# Altium project JuniorDesign_FinalProj.PrjPcb
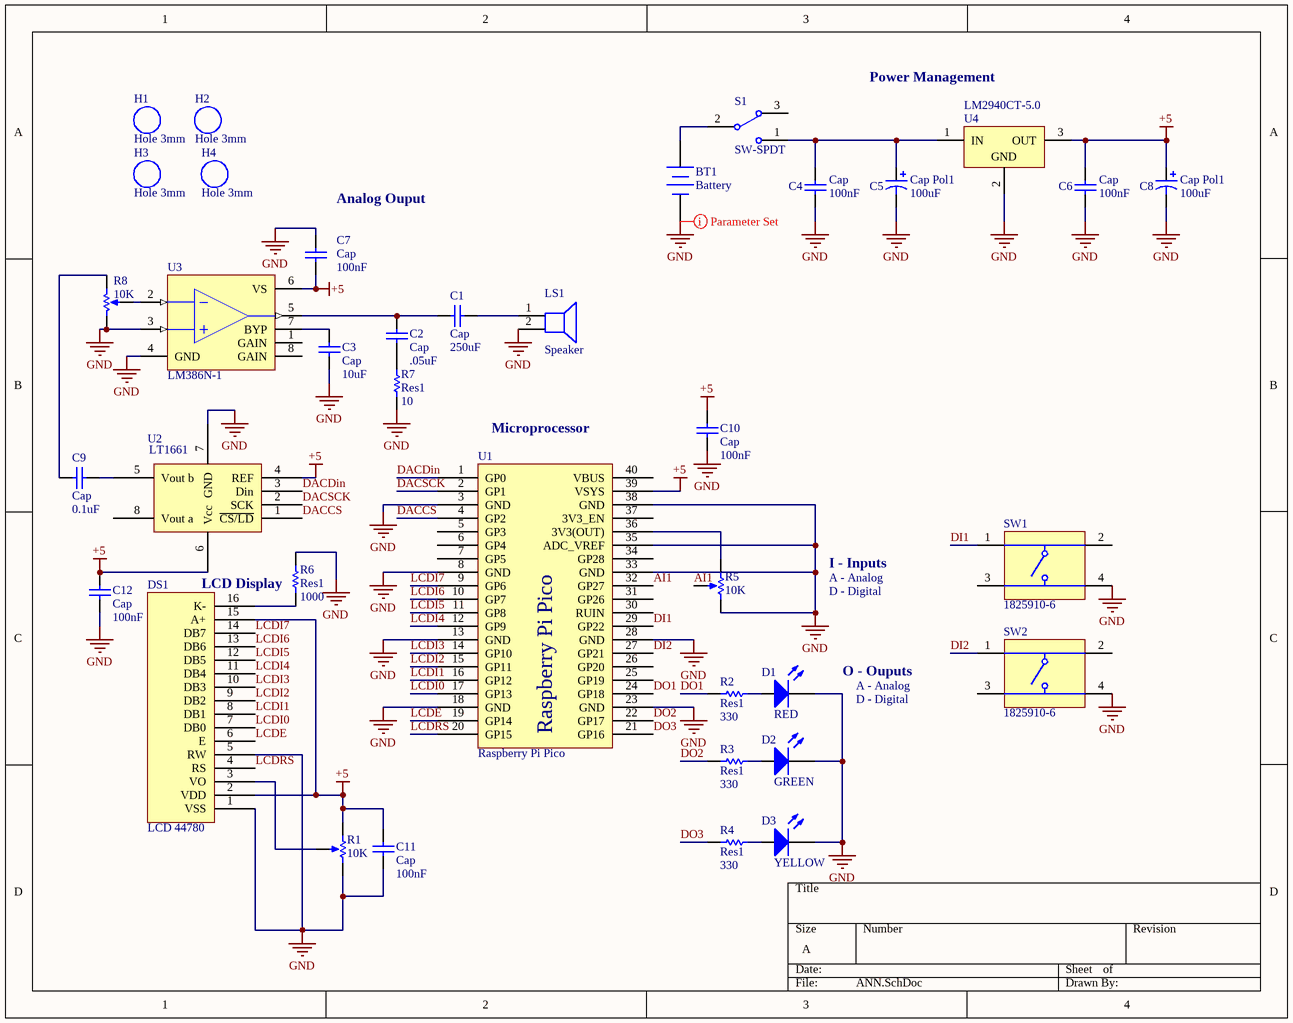
[diagram p0: ANN.SchDoc]
1 sheet, 37 parts. Net scope: global (net labels, ports and power ports of the same name join across sheets).
Board file: ANN.PcbDoc

## Sheet ANN.SchDoc
size A; SheetNumber: 1; SheetTotal: 1; SPICEModelCacheXOHBOOKO: <root> / <DocumentId>XOHBOOKO</DocumentId> / <CacheFrame Number="0"> / <Model Name="led0" Kind="MDL"> / <Text>*Typ INFRARED GaAs LED: Vf=1.2V Vr=5V If=40mA trr=3uS / *LED Pinout: 1=A, 2=K / .MODEL LED0 D (IS=93.5P RS=84M N=2.63 BV=5 IBV=10U / + CJO=2.97P VJ=.75 M=.333 TT=4.32U)</Text> / </Model> / </CacheFrame> / </root>

### Parts
BT1  Battery  [BAT-2]
C1  Cap  value 250uF  [RAD-0.3]
C2  Cap  value .05uF  [RAD-0.3]
C3  Cap  value 10uF  [RAD-0.3]
C4  Cap  value 100nF  [RAD-0.3]
C5  Cap Pol1  value 100uF  [RB7.6-15]
C6  Cap  value 100nF  [RAD-0.3]
C7  Cap  value 100nF  [RAD-0.3]
C8  Cap Pol1  value 100uF  [RB7.6-15]
C9  Cap  value 0.1uF  [RAD-0.3]
C10  Cap  value 100nF  [RAD-0.3]
C11  Cap  value 100nF  [RAD-0.3]
C12  Cap  value 100nF  [RAD-0.3]
D1  RED  [LED-0]
D2  GREEN  [LED-0]
D3  YELLOW  [LED-0]
DS1  LCD 44780  [OLED 16x2]
H1  Hole 3mm  [Hole 3mm]
H2  Hole 3mm  [Hole 3mm]
H3  Hole 3mm  [Hole 3mm]
H4  Hole 3mm  [Hole 3mm]
LS1  Speaker  [PIN2]
R1  value 10K  [POT OFFSET 100_1]  (hidden comment: RPot_2)
R2  Res1  value 330  [AXIAL-0.3]
R3  Res1  value 330  [AXIAL-0.3]
R4  Res1  value 330  [AXIAL-0.3]
R5  value 10K  [POT OFFSET 100_1]  (hidden comment: RPot_2)
R6  Res1  value 1000  [AXIAL-0.3]
R7  Res1  value 10  [AXIAL-0.3]
R8  value 10K  [POT OFFSET 100_1]  (hidden comment: RPot_2)
S1  SW-SPDT  [SW DPST jameco]
SW1  1825910-6  [TECO-1825910-6_V]
SW2  1825910-6  [TECO-1825910-6_V]
U1  Raspberry Pi Pico  [Raspberry Pi Pico]
U2  LT1661  [DIP-8]
U3  LM386N-1  [DIP-8]
U4  LM2940CT-5.0  [T03B]

### Nets
+5: C6.2 C7.2 C8.1 C10.2 C11.2 C12.2 DS1.2(VDD) DS1.15(A+) R1.1(TOP) U1.39(VSYS) U2.4(REF) U2.6(Vcc) U3.6(VS) U4.3(OUT)
GND: BT1.2(-) C3.1 C4.1 C5.2 C6.1 C7.1 C8.2 C10.1 C11.1 C12.1 D1.2(K) D2.2(K) D3.2(K) DS1.1(VSS) DS1.5(RW) LS1.2 R1.3(BOT) R5.3(BOT) R6.2 R7.1 R8.3(BOT) SW1.4 SW2.4 U1.3(GND) U1.8(GND) U1.13(GND) U1.18(GND) U1.23(GND) U1.28(GND) U1.33(GND) U1.35(ADC_VREF) U1.38(GND) U2.7(GND) U3.3(IN+) U3.4(GND) U4.2(GND)
AI1: R5.2(TAP) U1.32(GP27)
DACCS: U1.4(GP2) U2.1(~{CS/LD})
DACDin: U1.1(GP0) U2.3(Din)
DACSCK: U1.2(GP1) U2.2(SCK)
DI1: SW1.1 U1.29(GP22)
DI2: SW2.1 U1.27(GP21)
DO1: R2.1 U1.24(GP18)
DO2: R3.1 U1.22(GP17)
DO3: R4.1 U1.21(GP16)
LCDE: DS1.6(E) U1.19(GP14)
LCDI0: DS1.7(DB0) U1.17(GP13)
LCDI1: DS1.8(DB1) U1.16(GP12)
LCDI2: DS1.9(DB2) U1.15(GP11)
LCDI3: DS1.10(DB3) U1.14(GP10)
LCDI4: DS1.11(DB4) U1.12(GP9)
LCDI5: DS1.12(DB5) U1.11(GP8)
LCDI6: DS1.13(DB6) U1.10(GP7)
LCDI7: DS1.14(DB7) U1.9(GP6)
LCDRS: DS1.4(RS) U1.20(GP15)
NetBT1_1: BT1.1(+) S1.2
NetC1_1: C1.1 LS1.1
NetC1_2: C1.2 C2.2 U3.5(OUT)
NetC2_1: C2.1 R7.2
NetC3_2: C3.2 U3.7(BYP)
NetC4_2: C4.2 C5.1 S1.1 U4.1(IN)
NetC9_1: C9.1 U2.5(Vout_b)
NetC9_2: C9.2 R8.1(TOP)
NetD1_1: D1.1(A) R2.2
NetD2_1: D2.1(A) R3.2
NetD3_1: D3.1(A) R4.2
NetDS1_3: DS1.3(VO) R1.2(TAP)
NetDS1_16: DS1.16(K-) R6.1
NetR5_1: R5.1(TOP) U1.36(3V3(OUT))
NetR8_2: R8.2(TAP) U3.2(IN-)

Not connected (* = marked no-connect by the designer): S1 3; SW1 2 3; SW2 2 3; U1 5(GP3) 6(GP4) 7(GP5) 25(GP19) 26(GP20) 30(RUIN) 31(GP26) 34(GP28) 37(3V3_EN) 40(VBUS); U2 8(Vout_a); U3 1(GAIN) 8(GAIN)

### Layout directives
rule Width Constraint [Pref Width = 30mil    Min Width = 30mil    Max Width = 30mil]: GND

### Notes on the sheet
- Power Management
- (near C7) Analog Ouput
- (near U1) Microprocessor
- I - Inputs
- LCD Display
- A - Analog
- D - Digital
- O - Ouputs

### Library data of the parts
BT1 = Battery: Multicell Battery; Published: 24-Mar-1999; LatestRevisionDate: 17-Jul-2002; LatestRevisionNote: Re-released for DXP Platform.; PackageReference: BAT-2; Publisher: Altium Limited; PackageDescription: Battery; 2 Leads
C1-C4 C6 C7 C9-C12 = Cap: Capacitor; Published: 8-Jun-2000; LatestRevisionDate: 17-Jul-2002; LatestRevisionNote: Re-released for DXP Platform.; PackageReference: RAD-0.3; Publisher: Altium Limited; PackageDescription: Radial Cap, Thru-Hole; 2 Leads; 0.3 in Pin Spacing
C5 C8 = Cap Pol1: Polarized Capacitor (Radial); Published: 8-Jun-2000; LatestRevisionDate: 17-Jul-2002; LatestRevisionNote: Re-released for DXP Platform.; PackageReference: RB7.6-15; Publisher: Altium Limited; PackageDescription: Polarized Capacitor (Radial); 2 Leads
D1-D3 = LED0: Typical INFRARED GaAs LED; Published: 8-Jun-2000; LatestRevisionDate: 08-Jul-2005; LatestRevisionNote: Mech Layer 1 removed.; PackageReference: LED-0; Publisher: Altium Limited; PackageDescription: LED; 2 Leads
LS1 = Speaker: Loudspeaker; Published: 24-Mar-1999; LatestRevisionDate: 17-Jul-2002; LatestRevisionNote: Re-released for DXP Platform.; PackageReference: PIN2; Publisher: Altium Limited
R1 R5 R8 = RPot_5: Potentiometer; Sim Note: Enter the Resistance value and the set point into parameter fields.; Set Position: 0.5; Published: 8-Jun-2000; LatestRevisionDate: 17-Jul-2002; LatestRevisionNote: Re-released for DXP Platform.; PackageReference: VR5; Publisher: Altium Limited; PackageDescription: Variable Resistor, Thru-Hole; 3 Leads
R2-R4 R6 R7 = Res1: Resistor; Published: 8-Jun-2000; LatestRevisionDate: 17-Jul-2002; LatestRevisionNote: Re-released for DXP Platform.; PackageReference: AXIAL-0.3; Publisher: Altium Limited; PackageDescription: Axial Device, Thru-Hole; 2 Leads; 0.3 in Pin Spacing
S1 = SW-SPDT: SPDT Subminiature Toggle Switch, Right Angle Mounting, Vertical Actuation; Published: 24-Mar-1999; LatestRevisionDate: 17-Dec-2003; LatestRevisionNote: Schematic revised, PCB Footprint replaced.; DatasheetVersion: 05-Dec-2000; PackageReference: TL36WW15050; Publisher: Altium Limited; PackageDescription: Switch; 4 Leads; ComponentLink1Description: Manufacturer Link; ComponentLink1URL: http://www.apem.com
SW1 SW2 = CMP-1684-00021-1: Tact Switch, SPST-NO, 0.05 A, -35 to 85 degC, 4-Pin THD, RoHS, Bulk; Manufacturer: TE Connectivity; Maximum Contact Resistance: 100mOhm; Mechanical Life: 100000Cycles; Bushing Type: Unthreaded; Switch Configuration: OFF(ON); Maximum DC Voltage Rating: 24V; Contact Rating @ Voltage: 0.05A@24VDC; Actuator Color: Black; Body Orientation: Straight; Function: MomentaryContact; Illumination: N/R; Actuator Style: RoundButton; Actuator Material: PolybutyleneTerephthalate; Dielectric Strength: 500VAC; Pole Throw Configuration: SPST; Actuator Length: 1.4mm; Product Weight: N/A; Contact Material: CopperAlloy; Housing Material: N/A; Terminal Type: PCPins; Minimum Insulation Resistance: 100MOhm; Package Description: 4-Pin Through Hole Device, Body 5.99 x 5.99 mm, Pitch 6.5 mm; Part No: 1825910-6; Package Reference: THD; Base Material: N/A; Manufacturer URL: http://www.te.com; Contact Plating: Silver; RoHS: Yes; Datasheet Version: Rev. C9; Electrical Life: 100000Cycles; Maximum AC Voltage Rating: N/A; Thread Size: N/R; Operating Temperature: -35to85C; Mounting: ThroughHole; Dimension: 5.99x5mm; Datasheet URL: http://www.te.com/commerce/DocumentDelivery/DDEController?Action=showdoc&DocId=Customer+Drawing%7F1825910%7FC9%7Fpdf%7FEnglish%7FENG_CD_1825910_C9.pdf%7F1825910-6; Family: 1825910; Seal Location: N/A; Seal Description: N/A; Packaging: N/A
U3 = LM386N-1: Low-Voltage Audio Power Amplifier; Published: 15-Apr-2002; DatasheetDocument: Sep-1997; PackageDocument: Sep-1997; PackageReference: N08E; Publisher: Altium Limited
U4 = LM2940CT-5.0_1: 1A Low Dropout Regulator, 3-pin TO-220; Manufacturer: National Semiconductor; PackageTopMarking: NSUZXYTTE#*LM2940CT*-5.0 P+; PowerWise: N; CompType: LDO IC; High-Reliability: Y; DatasheetVersion: Jan-2007; PackageVersion: revL, Jan-1992; PackageReference: T03B; PackageDescription: TO-220, Molded, 3 Lead, Straight; PartNumber: LM2940CT-5.0; RoHS: N; PinCount: 3; ComponentLink1Description: Manufacturer URL; ComponentLink1URL: http://www.national.com/; ComponentLink2Description: LM2940C Datasheet; ComponentLink2URL: http://www.national.com/ds/LM/LM2940C.pdf; ComponentLink3Description: LM2940C Web Page; ComponentLink3URL: http://www.national.com/pf/LM/LM2940C.html; ComponentLink4Description: T03B Package Page; ComponentLink4URL: http://www.national.com/packaging/folders/t03b.html